# Altium schematic sheet Sheet1.SchDoc: RBCM_Core
size A2; SheetNumber: 1; SheetTotal: 1
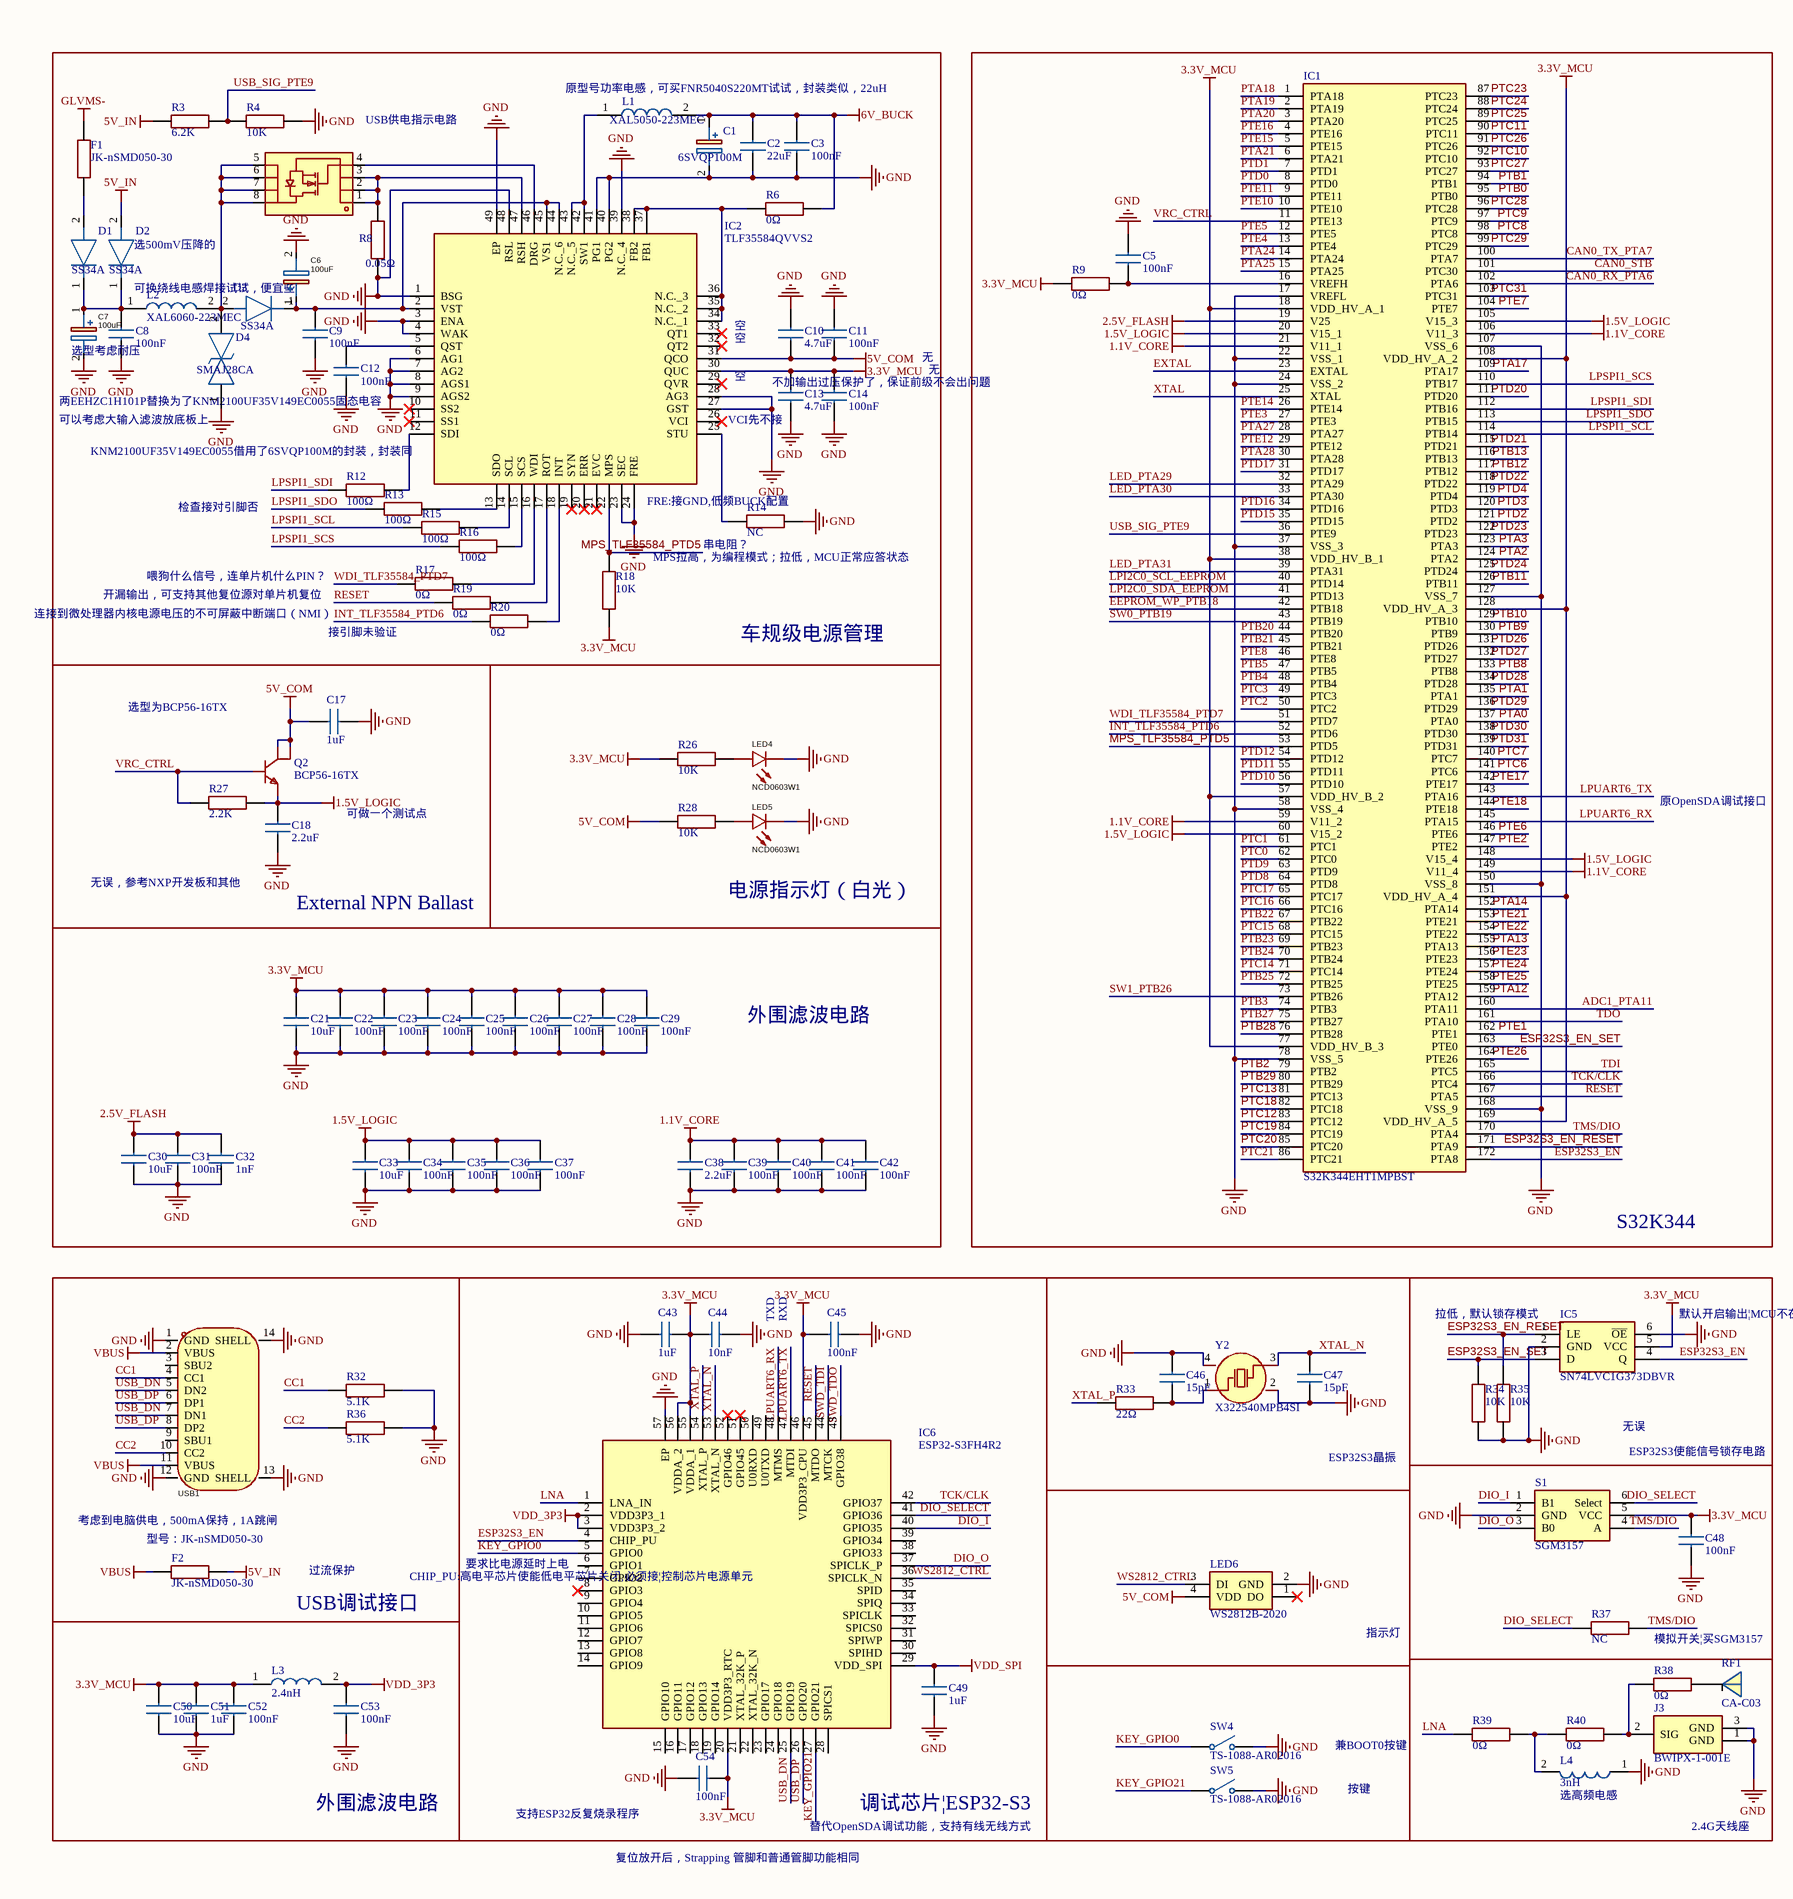
[diagram p0: Sheet1.SchDoc, left]
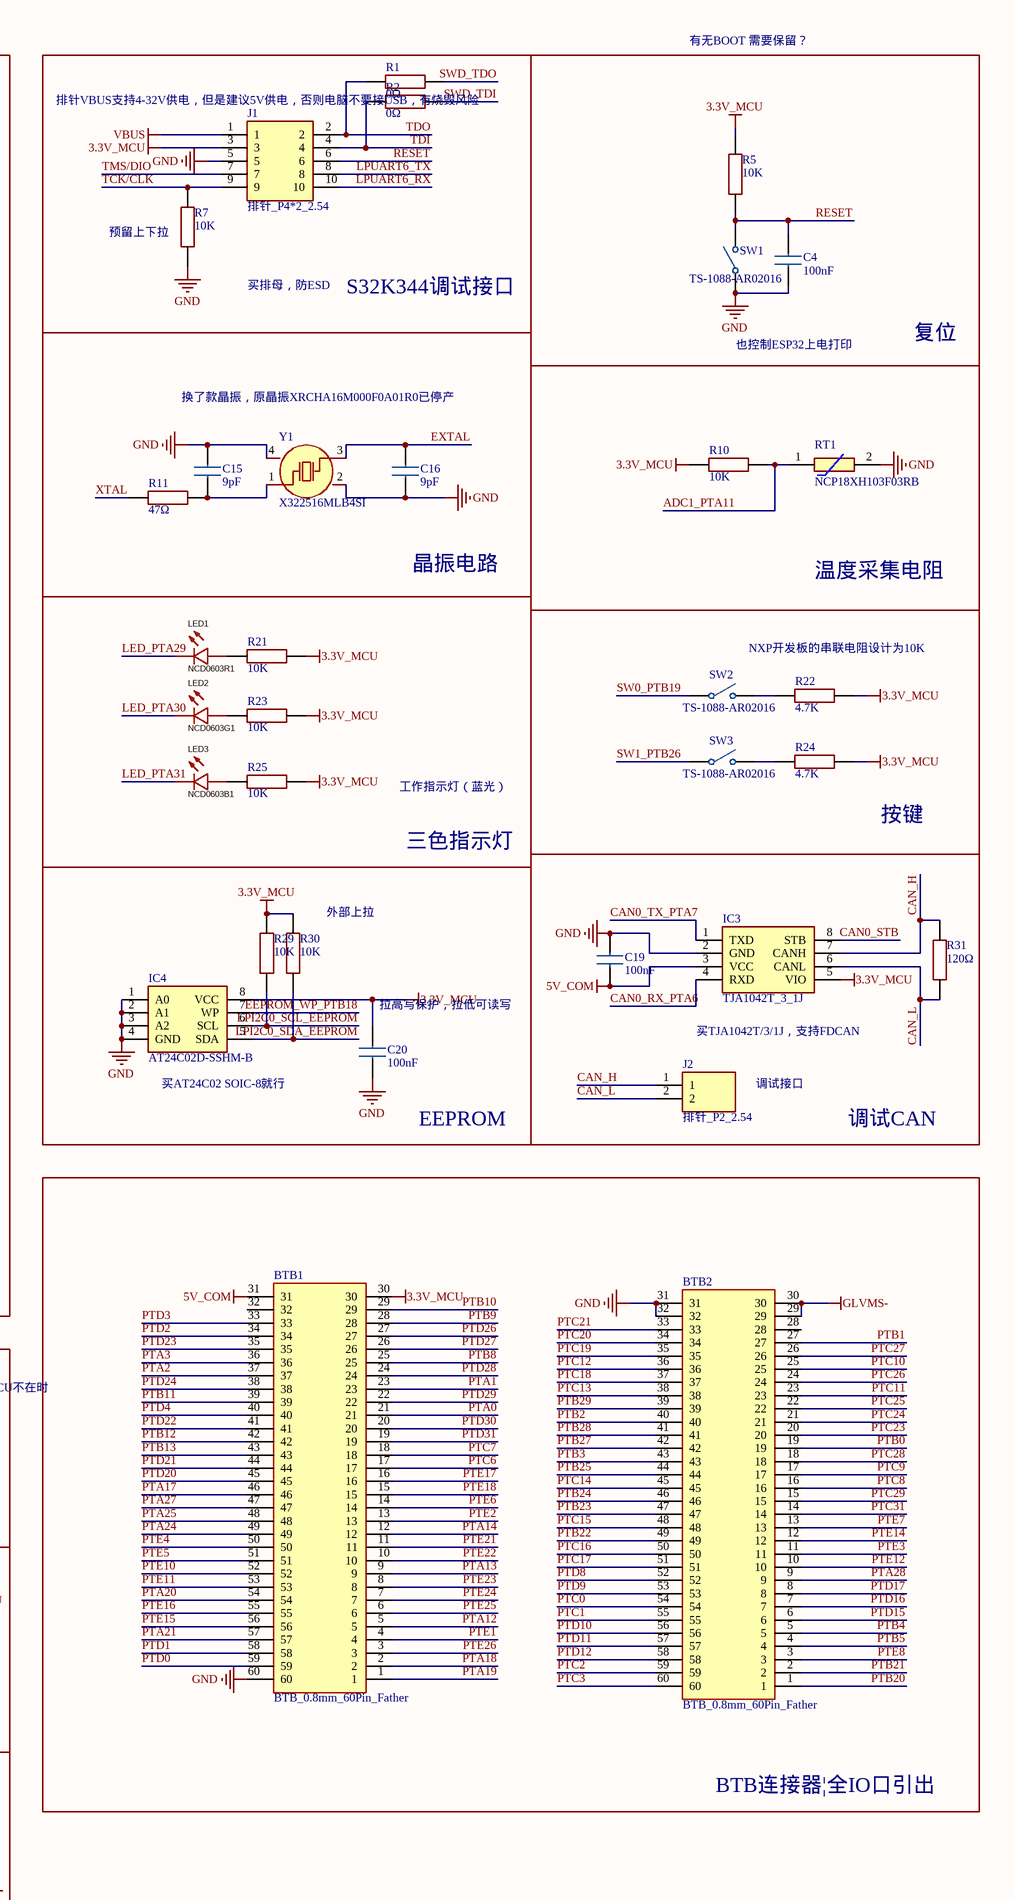
[diagram p1: Sheet1.SchDoc, right]

## Parts
BTB1  BTB_0.8mm_60Pin_Father  [BTB_0.8mm_60PIN_F]
BTB2  BTB_0.8mm_60Pin_Father  [BTB_0.8mm_60PIN_F]
C1  6SVQP100M  [16SVF180M]
C2  22uF  [CAPC1608X90N]
C3  100nF  [CAPC1608X90N]
C4  100nF  [CAPC1608X90N]
C5  100nF  [CAPC1608X90N]
C6  100uF  [16SVF180M]
C7  100uF  [16SVF180M]
C8  100nF  [CAPC1608X90N]
C9  100nF  [CAPC1608X90N]
C10  4.7uF  [CAPC1608X90N]
C11  100nF  [CAPC1608X90N]
C12  100nF  [CAPC1608X90N]
C13  4.7uF  [CAPC1608X90N]
C14  100nF  [CAPC1608X90N]
C15  9pF  [CAPC1608X90N]
C16  9pF  [CAPC1608X90N]
C17  1uF  [CAPC1608X90N]
C18  2.2uF  [CAPC1608X90N]
C19  100nF  [CAPC1608X90N]
C20  100nF  [CAPC1608X90N]
C21  10uF  [CAPC1608X90N]
C22  100nF  [CAPC1608X90N]
C23  100nF  [CAPC1608X90N]
C24  100nF  [CAPC1608X90N]
C25  100nF  [CAPC1608X90N]
C26  100nF  [CAPC1608X90N]
C27  100nF  [CAPC1608X90N]
C28  100nF  [CAPC1608X90N]
C29  100nF  [CAPC1608X90N]
C30  10uF  [CAPC1608X90N]
C31  100nF  [CAPC1608X90N]
C32  1nF  [CAPC1608X90N]
C33  10uF  [CAPC1608X90N]
C34  100nF  [CAPC1608X90N]
C35  100nF  [CAPC1608X90N]
C36  100nF  [CAPC1608X90N]
C37  100nF  [CAPC1608X90N]
C38  2.2uF  [CAPC1608X90N]
C39  100nF  [CAPC1608X90N]
C40  100nF  [CAPC1608X90N]
C41  100nF  [CAPC1608X90N]
C42  100nF  [CAPC1608X90N]
C43  1uF  [CAPC1608X90N]
C44  10nF  [CAPC1608X90N]
C45  100nF  [CAPC1608X90N]
C46  15pF  [CAPC1608X90N]
C47  15pF  [CAPC1608X90N]
C48  100nF  [CAPC1608X90N]
C49  1uF  [CAPC1608X90N]
C50  10uF  [CAPC1608X90N]
C51  1uF  [CAPC1608X90N]
C52  100nF  [CAPC1608X90N]
C53  100nF  [CAPC1608X90N]
C54  100nF  [CAPC1608X90N]
D1  SS34A  [DIOM5026X262N]
D2  SS34A  [DIOM5026X262N]
D3  SS34A  [DIOM5026X262N]
D4  SMAJ28CA  [DIONM5226X262N]
F1  JK-nSMD050-30  [RESC3116X65N]
F2  JK-nSMD050-30  [RESC3116X65N]
IC1  S32K344EHT1MPBST  [S32K344EHT1MPBST]
IC2  TLF35584QVVS2  [QFN50P700X700X90-49N-D]
IC3  TJA1042T_3_1J  [SOIC127P600X175-8N]
IC4  AT24C02D-SSHM-B  [SOIC127P600X175-8N]
IC5  SN74LVC1G373DBVR  [SOT95P280X145-6N]
IC6  ESP32-S3FH4R2  [QFN40P700X700X90-57N-D]
J1  排针_P4*2_2.54  [ZXPZ25425PZZ]
J2  排针_P2_2.54  [HDRV2W66P0X254_1X2_508X250X880P]
J3  BWIPX-1-001E  [BWIPX1001E]
L1  XAL5050-223MEC  [XAL5030]
L2  XAL6060-223MEC  [XAL6060822MEB]
L3  2.4nH  [LQM18FN100M00D]
L4  3nH  [LQM18FN100M00D]
LED1  NCD0603R1  [LED0603-RD]
LED2  NCD0603G1  [LED0603-RD_1]
LED3  NCD0603B1  [LED0603-RD]
LED4  NCD0603W1  [LED0603-RD]
LED5  NCD0603W1  [LED0603-RD]
LED6  WS2812B-2020  [WS2812B2020]
Q1  IPZ40N04S5L-7R4  [IPZ40N04S5L7R4ATMA1]  (value not drawn)
Q2  BCP56-16TX  [SOT230P700X180-4N]
R1  0Ω  [RESC1608X55N]
R2  0Ω  [RESC1608X55N]
R3  6.2K  [RESC1608X55N]
R4  10K  [RESC1608X55N]
R5  10K  [RESC1608X55N]
R6  0Ω  [RESC1608X55N]
R7  10K  [RESC1608X55N]
R8  0.05Ω  [RESC3116X65N]
R9  0Ω  [RESC1608X55N]
R10  10K  [RESC1608X55N]
R11  47Ω  [RESC1608X55N]
R12  100Ω  [RESC1608X55N]
R13  100Ω  [RESC1608X55N]
R14  NC  [RESC1608X55N]
R15  100Ω  [RESC1608X55N]
R16  100Ω  [RESC1608X55N]
R17  0Ω  [RESC1608X55N]
R18  10K  [RESC1608X55N]
R19  0Ω  [RESC1608X55N]
R20  0Ω  [RESC1608X55N]
R21  10K  [RESC1608X55N]
R22  4.7K  [RESC1608X55N]
R23  10K  [RESC1608X55N]
R24  4.7K  [RESC1608X55N]
R25  10K  [RESC1608X55N]
R26  10K  [RESC1608X55N]
R27  2.2K  [RESC1608X55N]
R28  10K  [RESC1608X55N]
R29  10K  [RESC1608X55N]
R30  10K  [RESC1608X55N]
R31  120Ω  [RESC1608X55N]
R32  5.1K  [RESC1608X55N]
R33  22Ω  [RESC1608X55N]
R34  10K  [RESC1608X55N]
R35  10K  [RESC1608X55N]
R36  5.1K  [RESC1608X55N]
R37  NC  [RESC1608X55N]
R38  0Ω  [RESC1608X55N]
R39  0Ω  [RESC1608X55N]
R40  0Ω  [RESC1608X55N]
RF1  CA-C03  [CA-C03]
RT1  NCP18XH103F03RB  [THRMC1608X95N]
S1  SGM3157  [SOT65P230X110-6N]
SW1  TS-1088-AR02016  [TS1088AR02016]
SW2  TS-1088-AR02016  [TS1088AR02016]
SW3  TS-1088-AR02016  [TS1088AR02016]
SW4  TS-1088-AR02016  [TS1088AR02016]
SW5  TS-1088-AR02016  [TS1088AR02016]
USB1  TYPE-C 16PIN 2MD(073)  [USB-C-SMD_TYPE-C-6PIN-2MD-073]  (value not drawn)
Y1  X322516MLB4SI  [X322516MLB4SI]
Y2  X322540MPB4SI  [X322540MPB4SI]

## Blocks framed on the sheet
车规级电源管理: C1-C3 C6-C14 D1-D4 F1 IC2 L1 L2 Q1 R3 R4 R6 R8 R12-R20
S32K344: C5 IC1 R9
S32K344调试接口: J1 R1 R2 R7
复位: C4 R5 SW1
晶振电路: C15 C16 R11 Y1
温度采集电阻: R10 RT1
三色指示灯: LED1-LED3 R21 R23 R25
按键: R22 R24 SW2 SW3
External NPN Ballast: C17 C18 Q2 R27
电源指示灯（白光）: LED4 LED5 R26 R28
调试CAN: C19 IC3 J2 R31
EEPROM: C20 IC4 R29 R30
外围滤波电路: C21-C42
BTB连接器¦全IO口引出: BTB1 BTB2
USB调试接口: F2 R32 R36 USB1
调试芯片¦ESP32-S3: C43-C45 C49 C54 IC6
ESP32S3晶振: C46 C47 R33 Y2
指示灯: LED6

## Nets
1.1V_CORE: C38.2 C39.2 C40.2 C41.2 C42.2 IC1.21(V11_1) IC1.59(V11_2) IC1.106(V11_3) IC1.149(V11_4)
1.5V_LOGIC: C18.2 C33.2 C34.2 C35.2 C36.2 C37.2 IC1.20(V15_1) IC1.60(V15_2) IC1.105(V15_3) IC1.148(V15_4) Q2.3(E) R27.2
2.5V_FLASH: C30.2 C31.2 C32.2 IC1.19(V25)
3.3V_MCU: BTB1.30 C13.2 C14.2 C20.2 C21.2 C22.2 C23.2 C24.2 C25.2 C26.2 C27.2 C28.2 C29.2 C43.2 C44.1 C45.1 C48.2 C50.2 C51.2 C52.2 C54.2 IC1.18(VDD_HV_A_1) IC1.38(VDD_HV_B_1) IC1.57(VDD_HV_B_2) IC1.77(VDD_HV_B_3) IC1.108(VDD_HV_A_2) IC1.128(VDD_HV_A_3) IC1.151(VDD_HV_A_4) IC1.169(VDD_HV_A_5) IC2.30(QUC) IC3.5(VIO) IC4.8(VCC) IC5.5(VCC) IC6.20(VDD3P3_RTC) IC6.46(VDD3P3_CPU) IC6.55(VDDA_1) IC6.56(VDDA_2) J1.3 L3.1 R5.2 R9.1 R10.1 R18.1 R21.2 R22.2 R23.2 R24.2 R25.2 R26.2 R29.2 R30.2 S1.5(VCC)
5V_COM: BTB1.31 C10.1 C11.1 C17.1 C19.1 IC2.31(QCO) IC3.3(VCC) LED6.4(VDD) Q2.2(C) Q2.4(C) R28.2
5V_IN: D2.2(A) F2.2 R3.1
6V_BUCK: C1.1(+) C2.2 C3.2 L1.2 R6.2
GLVMS-: BTB2.29 BTB2.30 F1.2
GND: BTB1.60 BTB2.31 BTB2.32 C1.2(-) C2.1 C3.1 C4.1 C5.2 C6.2(-) C7.2(-) C8.1 C9.1 C10.2 C11.2 C12.1 C13.1 C14.1 C15.2 C16.1 C17.2 C18.1 C19.2 C20.1 C21.1 C22.1 C23.1 C24.1 C25.1 C26.1 C27.1 C28.1 C29.1 C30.1 C31.1 C32.1 C33.1 C34.1 C35.1 C36.1 C37.1 C38.1 C39.1 C40.1 C41.1 C42.1 C43.1 C44.2 C45.2 C46.2 C47.1 C48.1 C49.1 C50.1 C51.1 C52.1 C53.1 C54.1 D4.1 IC1.17(VREFL) IC1.22(VSS_1) IC1.24(VSS_2) IC1.37(VSS_3) IC1.58(VSS_4) IC1.78(VSS_5) IC1.107(VSS_6) IC1.127(VSS_7) IC1.150(VSS_8) IC1.168(VSS_9) IC2.1(BSG) IC2.3(ENA) IC2.4(WAK) IC2.6(AG1) IC2.7(AG2) IC2.8(AGS1) IC2.9(AGS2) IC2.23(SEC) IC2.24(FRE) IC2.27(GST) IC2.28(AG3) IC2.39(N.C._4) IC2.40(PG2) IC2.41(PG1) IC2.48(RSL) IC2.49(EP) IC3.2(GND) IC4.1(A0) IC4.2(A1) IC4.3(A2) IC4.4(GND) IC5.2(GND) IC5.6(~{OE}) IC6.57(EP) J1.5 J3.1(GND) J3.3(GND) L4.1 LED4.1(-) LED5.1(-) LED6.2(GND) R4.2 R7.1 R8.1 R14.2 R32.2 R34.1 R35.1 R36.2 RT1.2 S1.2(GND) SW1.1(COMMON) SW4.2(NO) SW5.2(NO) USB1.1(GND) USB1.12(GND) USB1.13(SHELL) USB1.14(SHELL) Y1.2(GND) Y1.4(GND) Y2.2(GND) Y2.4(GND)
VBUS: F2.1 J1.1 USB1.2(VBUS) USB1.11(VBUS)
VDD_3P3: C53.2 IC6.2(VDD3P3_1) IC6.3(VDD3P3_2) L3.2
VDD_SPI: C49.2 IC6.29(VDD_SPI)
ADC1_PTA11: IC1.160(PTA11) R10.2 RT1.1
CAN0_RX_PTA6: IC1.102(PTA6) IC3.4(RXD)
CAN0_STB: IC1.101(PTC30) IC3.8(STB)
CAN0_TX_PTA7: IC1.100(PTA7) IC3.1(TXD)
CAN_H: IC3.7(CANH) J2.1 R31.2
CAN_L: IC3.6(CANL) J2.2 R31.1
CC1: R32.1 USB1.4(CC1)
CC2: R36.1 USB1.10(CC2)
DIO_I: IC6.40(GPIO35) S1.1(B1)
DIO_O: IC6.37(SPICLK_P) S1.3(B0)
DIO_SELECT: IC6.41(GPIO36) R37.1 S1.6(Select)
EEPROM_WP_PTB18: IC1.42(PTB18) IC4.7(WP)
ESP32S3_EN: IC1.172(PTA8) IC5.4(Q) IC6.4(CHIP_PU)
ESP32S3_EN_RESET: IC1.171(PTA9) IC5.1(LE) R35.2
ESP32S3_EN_SET: IC1.163(PTE0) IC5.3(D) R34.2
EXTAL: C16.2 IC1.23(EXTAL) Y1.3(OSC2)
INT_TLF35584_PTD6: IC1.52(PTD6) R20.1
KEY_GPIO0: IC6.5(GPIO0) SW4.1(COMMON)
KEY_GPIO21: IC6.27(GPIO21) SW5.1(COMMON)
LED_PTA29: IC1.32(PTA29) LED1.1(K)
LED_PTA30: IC1.33(PTA30) LED2.1(K)
LED_PTA31: IC1.39(PTA31) LED3.1(-)
LNA: IC6.1(LNA_IN) R39.1
LPI2C0_SCL_EEPROM: IC1.40(PTD14) IC4.6(SCL) R29.1
LPI2C0_SDA_EEPROM: IC1.41(PTD13) IC4.5(SDA) R30.1
LPSPI1_SCL: IC1.114(PTB14) R15.1
LPSPI1_SCS: IC1.110(PTB17) R16.1
LPSPI1_SDI: IC1.112(PTB16) R12.1
LPSPI1_SDO: IC1.113(PTB15) R13.1
LPUART6_RX: IC1.145(PTA15) IC6.48(MTMS) J1.10
LPUART6_TX: IC1.143(PTA16) IC6.47(MTDI) J1.8
MPS_TLF35584_PTD5: IC1.53(PTD5) IC2.22(MPS) R18.2
PTA0: BTB1.21 IC1.137(PTA0)
PTA1: BTB1.23 IC1.135(PTA1)
PTA2: BTB1.37 IC1.124(PTA2)
PTA3: BTB1.36 IC1.123(PTA3)
PTA12: BTB1.5 IC1.159(PTA12)
PTA13: BTB1.9 IC1.155(PTA13)
PTA14: BTB1.12 IC1.152(PTA14)
PTA17: BTB1.46 IC1.109(PTA17)
PTA18: BTB1.2 IC1.1(PTA18)
PTA19: BTB1.1 IC1.2(PTA19)
PTA20: BTB1.54 IC1.3(PTA20)
PTA21: BTB1.57 IC1.6(PTA21)
PTA24: BTB1.49 IC1.14(PTA24)
PTA25: BTB1.48 IC1.15(PTA25)
PTA27: BTB1.47 IC1.28(PTA27)
PTA28: BTB2.9 IC1.30(PTA28)
PTB0: BTB2.19 IC1.95(PTB0)
PTB1: BTB2.27 IC1.94(PTB1)
PTB2: BTB2.40 IC1.79(PTB2)
PTB3: BTB2.43 IC1.74(PTB3)
PTB4: BTB2.5 IC1.48(PTB4)
PTB5: BTB2.4 IC1.47(PTB5)
PTB8: BTB1.25 IC1.133(PTB8)
PTB9: BTB1.28 IC1.130(PTB9)
PTB10: BTB1.29 IC1.129(PTB10)
PTB11: BTB1.39 IC1.126(PTB11)
PTB12: BTB1.42 IC1.117(PTB12)
PTB13: BTB1.43 IC1.116(PTB13)
PTB20: BTB2.1 IC1.44(PTB20)
PTB21: BTB2.2 IC1.45(PTB21)
PTB22: BTB2.49 IC1.67(PTB22)
PTB23: BTB2.47 IC1.69(PTB23)
PTB24: BTB2.46 IC1.70(PTB24)
PTB25: BTB2.44 IC1.72(PTB25)
PTB27: BTB2.42 IC1.75(PTB27)
PTB28: BTB2.41 IC1.76(PTB28)
PTB29: BTB2.39 IC1.80(PTB29)
PTC0: BTB2.54 IC1.62(PTC0)
PTC1: BTB2.55 IC1.61(PTC1)
PTC2: BTB2.59 IC1.50(PTC2)
PTC3: BTB2.60 IC1.49(PTC3)
PTC6: BTB1.17 IC1.141(PTC6)
PTC7: BTB1.18 IC1.140(PTC7)
PTC8: BTB2.16 IC1.98(PTC8)
PTC9: BTB2.17 IC1.97(PTC9)
PTC10: BTB2.25 IC1.92(PTC10)
PTC11: BTB2.23 IC1.90(PTC11)
PTC12: BTB2.36 IC1.83(PTC12)
PTC13: BTB2.38 IC1.81(PTC13)
PTC14: BTB2.45 IC1.71(PTC14)
PTC15: BTB2.48 IC1.68(PTC15)
PTC16: BTB2.50 IC1.66(PTC16)
PTC17: BTB2.51 IC1.65(PTC17)
PTC18: BTB2.37 IC1.82(PTC18)
PTC19: BTB2.35 IC1.84(PTC19)
PTC20: BTB2.34 IC1.85(PTC20)
PTC21: BTB2.33 IC1.86(PTC21)
PTC23: BTB2.20 IC1.87(PTC23)
PTC24: BTB2.21 IC1.88(PTC24)
PTC25: BTB2.22 IC1.89(PTC25)
PTC26: BTB2.24 IC1.91(PTC26)
PTC27: BTB2.26 IC1.93(PTC27)
PTC28: BTB2.18 IC1.96(PTC28)
PTC29: BTB2.15 IC1.99(PTC29)
PTC31: BTB2.14 IC1.103(PTC31)
PTD0: BTB1.59 IC1.8(PTD0)
PTD1: BTB1.58 IC1.7(PTD1)
PTD2: BTB1.34 IC1.121(PTD2)
PTD3: BTB1.33 IC1.120(PTD3)
PTD4: BTB1.40 IC1.119(PTD4)
PTD8: BTB2.52 IC1.64(PTD8)
PTD9: BTB2.53 IC1.63(PTD9)
PTD10: BTB2.56 IC1.56(PTD10)
PTD11: BTB2.57 IC1.55(PTD11)
PTD12: BTB2.58 IC1.54(PTD12)
PTD15: BTB2.6 IC1.35(PTD15)
PTD16: BTB2.7 IC1.34(PTD16)
PTD17: BTB2.8 IC1.31(PTD17)
PTD20: BTB1.45 IC1.111(PTD20)
PTD21: BTB1.44 IC1.115(PTD21)
PTD22: BTB1.41 IC1.118(PTD22)
PTD23: BTB1.35 IC1.122(PTD23)
PTD24: BTB1.38 IC1.125(PTD24)
PTD26: BTB1.27 IC1.131(PTD26)
PTD27: BTB1.26 IC1.132(PTD27)
PTD28: BTB1.24 IC1.134(PTD28)
PTD29: BTB1.22 IC1.136(PTD29)
PTD30: BTB1.20 IC1.138(PTD30)
PTD31: BTB1.19 IC1.139(PTD31)
PTE1: BTB1.4 IC1.162(PTE1)
PTE2: BTB1.13 IC1.147(PTE2)
PTE3: BTB2.11 IC1.27(PTE3)
PTE4: BTB1.50 IC1.13(PTE4)
PTE5: BTB1.51 IC1.12(PTE5)
PTE6: BTB1.14 IC1.146(PTE6)
PTE7: BTB2.13 IC1.104(PTE7)
PTE8: BTB2.3 IC1.46(PTE8)
PTE10: BTB1.52 IC1.10(PTE10)
PTE11: BTB1.53 IC1.9(PTE11)
PTE12: BTB2.10 IC1.29(PTE12)
PTE14: BTB2.12 IC1.26(PTE14)
PTE15: BTB1.56 IC1.5(PTE15)
PTE16: BTB1.55 IC1.4(PTE16)
PTE17: BTB1.16 IC1.142(PTE17)
PTE18: BTB1.15 IC1.144(PTE18)
PTE21: BTB1.11 IC1.153(PTE21)
PTE22: BTB1.10 IC1.154(PTE22)
PTE23: BTB1.8 IC1.156(PTE23)
PTE24: BTB1.7 IC1.157(PTE24)
PTE25: BTB1.6 IC1.158(PTE25)
PTE26: BTB1.3 IC1.164(PTE26)
RESET: C4.2 IC1.167(PTA5) IC6.45(MTDO) J1.6 R5.1 R19.1 SW1.2(NO)
SW0_PTB19: IC1.43(PTB19) SW2.1(COMMON)
SW1_PTB26: IC1.73(PTB26) SW3.1(COMMON)
SWD_TDI: IC6.44(MTCK) R2.2
SWD_TDO: IC6.43(GPIO38) R1.2
TCK/CLK: IC1.166(PTC4) IC6.42(GPIO37) J1.9 R7.2
TDI: IC1.165(PTC5) J1.4 R2.1
TDO: IC1.161(PTA10) J1.2 R1.1
TMS/DIO: IC1.170(PTA4) J1.7 R37.2 S1.4(A)
USB_DN: IC6.25(GPIO19) USB1.5(DN2) USB1.7(DN1)
USB_DP: IC6.26(GPIO20) USB1.6(DP1) USB1.8(DP2)
USB_SIG_PTE9: IC1.36(PTE9) R3.2 R4.1
VRC_CTRL: IC1.11(PTE13) Q2.1(B) R27.1
WDI_TLF35584_PTD7: IC1.51(PTD7) R17.1
WS2812_CTRL: IC6.36(SPICLK_N) LED6.3(DI)
XTAL: IC1.25(XTAL) R11.1
XTAL_N: C47.2 IC6.53(XTAL_N) Y2.3(OSC2)
XTAL_P: IC6.54(XTAL_P) R33.1
NetC5_1: C5.1 IC1.16(VREFH) R9.2
NetC6_1: C6.1(+) C9.2 D3.1(K) IC2.2(VST) IC2.44(N.C._6) IC2.45(VS1)
NetC7_1: C7.1(+) C8.2 D1.1(K) D2.1(K) L2.1
NetC12_2: C12.2 IC2.5(QST)
NetC15_1: C15.1 R11.2 Y1.1(OSC1)
NetC46_1: C46.1 R33.2 Y2.1(OSC1)
NetD1_2: D1.2(A) F1.1
NetD3_2: D3.2(A) D4.2 L2.2 Q1.5(D) Q1.6(D) Q1.7(D) Q1.8(D)
NetIC2_12: IC2.12(SDI) R12.2
NetIC2_13: IC2.13(SDO) R13.2
NetIC2_14: IC2.14(SCL) R15.2
NetIC2_15: IC2.15(SCS) R16.2
NetIC2_16: IC2.16(WDI) R17.2
NetIC2_17: IC2.17(ROT) R19.2
NetIC2_18: IC2.18(INT) R20.2
NetIC2_25: IC2.25(STU) R14.1
NetIC2_34: IC2.34(N.C._1) IC2.35(N.C._2) IC2.36(N.C._3) IC2.37(FB1) IC2.38(FB2) R6.1
NetIC2_42: IC2.42(SW1) IC2.43(N.C._5) L1.1
NetIC2_46: IC2.46(DRG) Q1.4(G)
NetIC2_47: IC2.47(RSH) Q1.1(S) Q1.2(S) Q1.3(S) R8.2
NetJ3_2: J3.2(SIG) R38.1 R40.2
NetL4_2: L4.2 R39.2 R40.1
NetLED1_2: LED1.2(A) R21.1
NetLED2_2: LED2.2(A) R23.1
NetLED3_2: LED3.2(+) R25.1
NetLED4_2: LED4.2(+) R26.1
NetLED5_2: LED5.2(+) R28.1
NetR22_1: R22.1 SW2.2(NO)
NetR24_1: R24.1 SW3.2(NO)
NetR38_2: R38.2 RF1.1

Not connected (* = marked no-connect by the designer): BTB1 32; BTB2 28; IC2 10(SS2)* 11(SS1)* 19(SYN)* 20(ERR)* 21(EVC)* 26(VCI)* 29(QVR)* 32(QT2)* 33(QT1)*; IC6 6(GPIO1) 7(GPIO2) 8(GPIO3)* 9(GPIO4) 10(GPIO5) 11(GPIO6) 12(GPIO7) 13(GPIO8) 14(GPIO9) 15(GPIO10) 16(GPIO11) 17(GPIO12) 18(GPIO13) 19(GPIO14) 21(XTAL_32K_P) 22(XTAL_32K_N) 23(GPIO17) 24(GPIO18) 28(SPICS1) 30(SPIHD) 31(SPIWP) 32(SPICS0) 33(SPICLK) 34(SPIQ) 35(SPID) 38(GPIO33) 39(GPIO34) 49(U0TXD) 50(U0RXD) 51(GPIO45)* 52(GPIO46)*; LED6 1(DO)*; RF1 2; USB1 3(SBU2) 9(SBU1)

## Notes on the sheet
- 原型号功率电感，可买FNR5040S220MT试试，封装类似，22uH
- 有无BOOT 需要保留？
- (near Q1) USB供电指示电路
- (near J1) 排针VBUS支持4-32V供电，但是建议5V供电，否则电脑不要接USB，有烧毁风险
- (near D2) 选500mV压降的
- (near R7) 预留上下拉
- 买排母，防ESD
- 可换绕线电感焊接试试，便宜些
- 空
- 也控制ESP32上电打印
- (near C7) 选型考虑耐压
- 不加输出过压保护了，保证前级不会出问题
- 无
- 换了款晶振，原晶振XRCHA16M000F0A01R0已停产
- 可以考虑大输入滤波放底板上
- (near D4) 两EEHZC1H101P替换为了KNM2100UF35V149EC0055固态电容
- KNM2100UF35V149EC0055借用了6SVQP100M的封装，封装同
- VCI先不接
- 检查接对引脚否
- FRE:接GND,低频BUCK配置
- 喂狗什么信号，连单片机什么PIN？
- MPS拉高，为编程模式；拉低，MCU正常应答状态
- (near R14) 串电阻？
- 连接到微处理器内核电源电压的不可屏蔽中断端口（NMI）
- 开漏输出，可支持其他复位源对单片机复位
- 接引脚未验证
- NXP开发板的串联电阻设计为10K
- 选型为BCP56-16TX
- 工作指示灯（蓝光）
- 可做一个测试点
- 原OpenSDA调试接口
- 无误，参考NXP开发板和其他
- (near R30) 外部上拉
- (near C20) 拉高写保护，拉低可读写
- 买TJA1042T/3/1J，支持FDCAN
- (near IC4) 买AT24C02 SOIC-8就行
- 调试接口
- TXD
- RXD
- 拉低，默认锁存模式
- (near IC5) 默认开启输出¦MCU不在时
- 无误
- ESP32S3使能信号锁存电路
- 考虑到电脑供电，500mA保持，1A跳闸
- (near F2) 型号：JK-nSMD050-30
- 过流保护
- (near IC6) CHIP_PU:高电平芯片使能低电平芯片关闭,必须接¦控制芯片电源单元
- 要求比电源延时上电
- 模拟开关¦买SGM3157
- 兼BOOT0按键
- 外围滤波电路
- 支持ESP32反复烧录程序
- 替代OpenSDA调试功能，支持有线无线方式
- 按键
- (near L4) 选高频电感
- 2.4G天线座
- 复位放开后，Strapping 管脚和普通管脚功能相同
- ENG:
- DSN:
- APPROVALS
- DATE
- PROJECT REVISION:
- Vehicle Number:
- E33
- DOCUMENT REVISION:
- Wuhan University of Techonology
- Formula Student Electric Racing Team
- No. 122, Luoshi Road, Wuhan
- Hubei Provence, China
- Design Item:
- CHK:
- BOM:
- REFERENCE DOCUMENTS
- TITLE
- FAB DWG:
- PCB DWG:
- ASSY DWG:
- SCALE:
- A1
- SIZE
- FILE NAME
- WUTE racing team
- SHEET
- OF
- REV

## Library data of the parts
BTB1 BTB2 = BTB_0.8mm_60Pin_Father: System: Connector
C1 = 6SVQP100M: Capacitor Polarised; Manufacturer_Name: Panasonic; Datasheet Link: http://industrial.panasonic.com/cdbs/www-data/pdf/AAB8000/AAB8000C225.pdf; Height: 6mm; Manufacturer_Part_Number: 6SVQP100M; Mouser Part Number: 667-6SVQP100M; Mouser Price/Stock: https://www.mouser.co.uk/ProductDetail/Panasonic/6SVQP100M?qs=Gd3Cm49KlLNMtA4%252BBRbdEg%3D%3D; Arrow Part Number: 6SVQP100M; Arrow Price/Stock: https://www.arrow.com/en/products/6svqp100m/panasonic?region=nac
C2-C5 C8-C54 = C0603: Capacitor CC0603KRX7R9BB104; Manufacturer_Name: YAGEO; Datasheet Link: https://componentsearchengine.com/Datasheets/2/CC0603KRX7R9BB104.pdf; Height: 0.9mm; Manufacturer_Part_Number: CC0603KRX7R9BB104; Mouser Part Number: 603-CC603KRX7R9BB104; Mouser Price/Stock: https://www.mouser.co.uk/ProductDetail/YAGEO/CC0603KRX7R9BB104?qs=vTakOoo5QyLvVCYM2ge8LQ%3D%3D; Arrow Part Number: CC0603KRX7R9BB104; Arrow Price/Stock: https://www.arrow.com/en/products/cc0603krx7r9bb104/yageo?region=europe
C6 C7 = KNM2100UF35V149EC0055: Manufacturer: KNSCHA(科尼盛); Add into BOM: yes; Tolerance: ±20%; Rated Voltage: 35V; Ripple Current: 1.516A@100kHz; Equivalent Series Resistance(ESR): 80mΩ@100kHz; φD: 6.3mm; L: 7mm; Lifetime @ Temp: 2000hrs@105℃; Symbol: KNM2100UF35V149EC0055; Device: KNM2100UF35V149EC0055; LCSC Part Name: 100uF ±20% 35V; Supplier Part: C2982822; Manufacturer Part: KNM2100UF35V149EC0055; Supplier Footprint: SMD,D6.3xL7mm; JLCPCB Part Class: Extended Part; Datasheet: https://atta.szlcsc.com/upload/public/pdf/source/20220426/5696DDB0B22BE88A3CF8D074D2573DF7.pdf; Supplier: LCSC; Convert to PCB: yes; Value: 100uF; Lead Spacing: 2.5mm; Operating Temperature: -55℃~+105℃
D1-D3 = SS34A: Diode; Manufacturer_Name: HY Electronic; Datasheet Link: https://datasheet.datasheetarchive.com/originals/distributors/Datasheets-3/DSA-43252.pdf; Height: 2.62mm; Manufacturer_Part_Number: SS34A
D4 = SMAJ28CA: TVS Diode (Bi-directional); Manufacturer_Name: Bourns; Datasheet Link: https://www.bourns.com/data/global/pdfs/SMAJ.pdf; Height: 2.62mm; Manufacturer_Part_Number: SMAJ28CA; Mouser Part Number: 652-SMAJ28CA; Mouser Price/Stock: https://www.mouser.co.uk/ProductDetail/Bourns/SMAJ28CA?qs=A3H9pljuJ8Rc2FOBsYvsOw%3D%3D; Arrow Part Number: SMAJ28CA; Arrow Price/Stock: https://www.arrow.com/en/products/smaj28ca/bourns?utm_currency=USD&region=nac
F1 F2 = R1206: Manufacturer_Name: UNI-ROYAL(Uniroyal Elec); Manufacturer_Part_Number: 1206W4F1002T5E; Datasheet Link: https://datasheet.lcsc.com/szlcsc/Uniroyal-Elec-1206W4F1002T5E_C17902.pdf; Height: 0.65mm
IC1 = S32K344EHT1MPBST: Integrated Circuit; Manufacturer_Name: NXP; Datasheet Link: https://www.nxp.com/docs/en/data-sheet/S32K3xx.pdf; Height: 1.75mm; Manufacturer_Part_Number: S32K344EHT1MPBST; Mouser Part Number: 771-S32K344EHT1MPBST; Mouser Price/Stock: https://www.mouser.co.uk/ProductDetail/NXP-Semiconductors/S32K344EHT1MPBST?qs=Rp5uXu7WBW8J9n%252BPyXjBKQ%3D%3D; Arrow Part Number: S32K344EHT1MPBST; Arrow Price/Stock: https://www.arrow.com/en/products/s32k344eht1mpbst/nxp-semiconductors?region=nac
IC2 = TLF35584QVVS2: Integrated Circuit; Manufacturer_Name: Infineon; Datasheet Link: http://www.farnell.com/datasheets/2820312.pdf; Height: 0.9mm; Manufacturer_Part_Number: TLF35584QVVS2; Mouser Part Number: N/A; Mouser Price/Stock: https://www.mouser.co.uk/ProductDetail/Infineon-Technologies/TLF35584QVVS2?qs=l9vRkkPGK2mbsGIT9lqTbg%3D%3D
IC3 = TJA1042T_3_1J: Integrated Circuit; Manufacturer_Name: NXP; Manufacturer_Part_Number: TJA1042T/3/1J; Datasheet Link: http://www.nxp.com/docs/en/data-sheet/TJA1042.pdf; Height: 1.75mm; Mouser Part Number: 771-TJA1042T/3/1J; Mouser Price/Stock: https://www.mouser.co.uk/ProductDetail/NXP-Semiconductors/TJA1042T-3-1J?qs=gNSudQoqUYC0yGbZKhqwlQ%3D%3D; Arrow Part Number: TJA1042T/3/1J; Arrow Price/Stock: https://www.arrow.com/en/products/tja1042t31j/nxp-semiconductors?utm_currency=USD&region=nac
IC4 = AT24C02D-SSHM-B: Integrated Circuit; Manufacturer_Name: Microchip; Datasheet Link: http://www.atmel.com/images/Atmel-8871-SEEPROM-AT24C01D-02D-Datasheet.pdf; Height: 1.75mm; Manufacturer_Part_Number: AT24C02D-SSHM-B; Mouser Part Number: 556-AT24C02D-SSHM-B; Mouser Price/Stock: https://www.mouser.co.uk/ProductDetail/Microchip-Technology/AT24C02D-SSHM-B?qs=l5F7KFZg3O5xH%2Fgf1EqmGg%3D%3D; Arrow Part Number: AT24C02D-SSHM-B; Arrow Price/Stock: https://www.arrow.com/en/products/at24c02d-sshm-b/microchip-technology?region=europe
IC5 = SN74LVC1G373DBVR: Integrated Circuit; Manufacturer_Name: Texas Instruments; Datasheet Link: http://www.ti.com/lit/gpn/sn74lvc1g373; Height: 1.45mm; Manufacturer_Part_Number: SN74LVC1G373DBVR; Mouser Part Number: 595-SN74LVC1G373DBVR; Mouser Price/Stock: https://www.mouser.co.uk/ProductDetail/Texas-Instruments/SN74LVC1G373DBVR?qs=pajgIaoyDUhGcf%252BSO1j05w%3D%3D; Arrow Part Number: SN74LVC1G373DBVR; Arrow Price/Stock: https://www.arrow.com/en/products/sn74lvc1g373dbvr/texas-instruments?region=nac
IC6 = ESP32-S3FH4R2: Integrated Circuit; Manufacturer_Name: Espressif Systems; Datasheet Link: https://eu.mouser.com/datasheet/2/891/esp32_s3_datasheet_en-2946743.pdf; Height: 0.9mm; Manufacturer_Part_Number: ESP32-S3FH4R2; Mouser Part Number: 356-ESP32-S3FH4R2; Mouser Price/Stock: https://www.mouser.co.uk/ProductDetail/Espressif-Systems/ESP32-S3FH4R2?qs=tlsG%2FOw5FFjPrwkmZSBQNA%3D%3D
J1 = 排针_P4*2_2.54: Connector; Manufacturer_Name: Megastar; Manufacturer_Part_Number: ZX-PZ2.54-2-5PZZ; Datasheet Link: https://www.lcsc.com/datasheet/lcsc_datasheet_2311221544_Megastar-ZX-PZ2-54-2-5PZZ_C7501276.pdf; Height: 8.7mm
J2 = 排针_P2_2.54: Connector; Manufacturer_Name: Ckmtw(Shenzhen Cankemeng); Manufacturer_Part_Number: B-2100S02P-A110; Datasheet Link: https://datasheet.lcsc.com/lcsc/2210192330_Ckmtw-Shenzhen-Cankemeng-B-2100S02P-A110_C124375.pdf; Height: 8.8mm
J3 = BWIPX-1-001E: Connector; Manufacturer_Name: BAT WIRELESS; Datasheet Link: https://datasheet.lcsc.com/szlcsc/2012231509_BAT-WIRELESS-BWIPX-1-001E_C496552.pdf; Height: 1.45mm; Manufacturer_Part_Number: BWIPX-1-001E
L1 = XAL5050-223MEC: Inductor; Manufacturer_Name: COILCRAFT; Datasheet Link: https://www.coilcraft.com/getmedia/49bc46c8-4b2c-45b9-9b6c-2eaa235ea698/xal50xx.pdf; Manufacturer_Part_Number: XAL5050-223MEC; Mouser Part Number: 994-XAL5050-223MEC; Mouser Price/Stock: https://www.mouser.co.uk/ProductDetail/Coilcraft/XAL5050-223MEC?qs=zCSbvcPd3pZDBbGj4RTtgg%3D%3D
L2 = XAL6060-223MEC: Inductor; Manufacturer_Name: COILCRAFT; Datasheet Link: http://www.mouser.com/datasheet/2/597/xal60xx-270658.pdf; Height: 6mm; Manufacturer_Part_Number: XAL6060-223MEC; Mouser Part Number: 994-XAL6060-223MEC; Mouser Price/Stock: https://www.mouser.co.uk/ProductDetail/Coilcraft/XAL6060-223MEC?qs=zCSbvcPd3paScsLbTnAUcA%3D%3D
L3 L4 = L0603: Inductor; Manufacturer_Name: Murata Electronics; Datasheet Link: https://psearch.en.murata.com/inductor/product/LQM18FN100M00%23.html; Height: 0.9mm; Manufacturer_Part_Number: LQM18FN100M00D; Mouser Part Number: 81-LQM18FN100M00D; Mouser Price/Stock: https://www.mouser.co.uk/ProductDetail/Murata-Electronics/LQM18FN100M00D?qs=2%252BM72CStpDR8E8wEVXa5xw%3D%3D; Arrow Part Number: LQM18FN100M00D; Arrow Price/Stock: https://www.arrow.com/en/products/lqm18fn100m00d/murata-manufacturing?region=nac
LED1 = NCD0603R1: C84263; Manufacturer: 国星光电; Symbol: FC-DA1608HRK-620D; Device: NCD0603R1_C84263; Add into BOM: yes; Emitted Color: 红色; Forward Voltage (VF): 1.6V~2.6V; Power Dissipation: 65mW; Forward Current: 20mA; Dominant Wavelength: 615nm~630nm; Diode Configuration: 独立二极管; Lens Color: 无色透明透镜; Luminous Intensity: 80mcd~220mcd; Viewing Angle: 130°; LCSC Part Name: NCD0603R1; Supplier Part: C84263; Manufacturer Part: NCD0603R1; Supplier Footprint: 0603; JLCPCB Part Class: Extended Part; Datasheet: https://atta.szlcsc.com/upload/public/pdf/source/20200820/C84263_DABC6A75E58F576973B407FDBA283D60.pdf; Supplier: LCSC; Convert to PCB: yes; Lamp Holder Type: -; Peak Wavelength: -; Color Temperature: -; Mounting Sytle: -; Operating Temperature: -30℃~+85℃
LED2 = NCD0603G1: Manufacturer: 国星光电; Symbol: FC-D1608UGK-520D10; Add into BOM: yes; Emitted Color: 翠绿色; Forward Voltage (VF): 2.6V~3.6V; Power Dissipation: 72mW; Forward Current: 10mA; Dominant Wavelength: 515nm~530nm; Lens Color: 无色透明透镜; Luminous Intensity: 330mcd~900mcd; Viewing Angle: 130°; Device: NCD0603G1; LCSC Part Name: NCD0603G1; Supplier Part: C84267; Manufacturer Part: NCD0603G1; Supplier Footprint: 0603; JLCPCB Part Class: Extended Part; Datasheet: https://atta.szlcsc.com/upload/public/pdf/source/20200820/C84267_04BA7703640BAC111D09F5EFB971FBF3.pdf; Supplier: LCSC; Convert to PCB: yes; Operating Temperature: -30℃~+85℃
LED3 = NCD0603B1: Manufacturer: 国星光电; Symbol: FC-DA1608BK-470H10; Add into BOM: yes; Emitted Color: 蓝色; Forward Voltage (VF): 2.6V~3.6V; Power Dissipation: 72mW; Forward Current: 10mA; Dominant Wavelength: 463nm~475nm; Lens Color: 无色透明透镜; Luminous Intensity: 80mcd~220mcd; Viewing Angle: 130°; Device: NCD0603B1; LCSC Part Name: NCD0603B1; Supplier Part: C84266; Manufacturer Part: NCD0603B1; Supplier Footprint: 0603; JLCPCB Part Class: Extended Part; Datasheet: https://atta.szlcsc.com/upload/public/pdf/source/20200820/C84266_6A3CDBEFA72C6CAD68EDA53474ADAE6C.pdf; Supplier: LCSC; Convert to PCB: yes; Operating Temperature: -30℃~+85℃
LED4 LED5 = NCD0603W1: Manufacturer: 国星光电; Symbol: FC-D1608WD-460H5; Add into BOM: yes; Emitted Color: 白色; Forward Voltage (VF): 2.6V~3.6V; Power Dissipation: 72mW; Forward Current: 5mA; Lens Color: 雾状黄透镜; Luminous Intensity: 200mcd~300mcd; Viewing Angle: 130°; Device: NCD0603W1; LCSC Part Name: NCD0603W1; Supplier Part: C84265; Manufacturer Part: NCD0603W1; Supplier Footprint: 0603; JLCPCB Part Class: Extended Part; Datasheet: https://atta.szlcsc.com/upload/public/pdf/source/20200820/C84265_479E6193713348A548E5CD6D9278BF16.pdf; Supplier: LCSC; Convert to PCB: yes; Operating Temperature: -30℃~+85℃
LED6 = WS2812B-2020: LED (Multiple); Manufacturer_Name: Worldsemi; Datasheet Link: https://www.alldatasheet.com/datasheet-pdf/pdf/1134522/WORLDSEMI/WS2812B-2020.html; Height: 0.84mm; Manufacturer_Part_Number: WS2812B-2020
Q1 = IPZ40N04S5L-7R4: Manufacturer: Infineon(英飞凌); Add into BOM: yes; Symbol: IPZ40N04S5L-7R4; Device: IPZ40N04S5L-7R4; LCSC Part Name: IPZ40N04S5L-7R4; Supplier Part: C537509; Manufacturer Part: IPZ40N04S5L-7R4; Supplier Footprint: TSDSON-8-EP(3.3x3.3); JLCPCB Part Class: Extended Part; Datasheet: https://atta.szlcsc.com/upload/public/pdf/source/20200525/C537509_E051284C2A14EA783116935AFB10216D.pdf; Supplier: LCSC; Convert to PCB: yes; Type: -; Drain Source Voltage (Vdss): -; Continuous Drain Current (Id): -; Power Dissipation (Pd): -; Drain Source On Resistance (RDS(on)@Vgs,Id): -; Gate Threshold Voltage (Vgs(th)@Id): -; Total Gate Charge (Qg@Vgs): -; Input Capacitance (Ciss@Vds): -; Reverse Transfer Capacitance (Crss@Vds): -
Q2 = BCP56-16TX: Transistor; Manufacturer_Name: Nexperia; Manufacturer_Part_Number: BCP56-16,115; Datasheet Link: https://assets.nexperia.com/documents/data-sheet/BCP56_BCX56_BC56PA.pdf; Height: 1.8mm; Mouser Part Number: 771-BCP56-16-T/R; Mouser Price/Stock: https://www.mouser.co.uk/ProductDetail/Nexperia/BCP56-16115?qs=me8TqzrmIYWgUkLKLwMxWw%3D%3D; Arrow Part Number: BCP56-16,115; Arrow Price/Stock: https://www.arrow.com/en/products/bcp56-16115/nexperia?utm_currency=USD&region=europe
R1-R7 R9-R40 = R0603: Resistor 0603WAF1002T5E; Manufacturer_Name: UNI-ROYAL(Uniroyal Elec); Datasheet Link: https://datasheet.lcsc.com/szlcsc/Uniroyal-Elec-0603WAF1002T5E_C25804.pdf; Height: 0.55mm; Manufacturer_Part_Number: 0603WAF1002T5E
R8 = R1206: Resistor 1206W4F1002T5E; Manufacturer_Name: UNI-ROYAL(Uniroyal Elec); Datasheet Link: https://datasheet.lcsc.com/szlcsc/Uniroyal-Elec-1206W4F1002T5E_C17902.pdf; Height: 0.65mm; Manufacturer_Part_Number: 1206W4F1002T5E
RT1 = NCP18XH103F03RB: Thermistor; Manufacturer_Name: Murata Electronics; Datasheet Link: https://componentsearchengine.com/Datasheets/2/NCP18XH103F03RB.pdf; Height: 0.95mm; Manufacturer_Part_Number: NCP18XH103F03RB; Mouser Part Number: 81-NCP18XH103F03RB; Mouser Price/Stock: https://www.mouser.co.uk/ProductDetail/Murata-Electronics/NCP18XH103F03RB?qs=k3rQb2PKXqkF9YvF09qsvw%3D%3D; Arrow Part Number: NCP18XH103F03RB; Arrow Price/Stock: https://www.arrow.com/en/products/ncp18xh103f03rb/murata-manufacturing?utm_currency=USD&region=nac
S1 = SGM3157: Switch; Manufacturer_Name: SGMICRO; Manufacturer_Part_Number: SGM3157YC6/TR; Datasheet Link: https://pdf1.alldatasheet.com/datasheet-pdf/view/224033/SGMICRO/SGM3157YC6/TR.html; Height: 1.1mm
SW1-SW5 = TS-1088-AR02016: Switch; Manufacturer_Name: XUNPU; Datasheet Link: https://www.xunpudianzi.com/uploads/pdf/TS-1088-ARXXX.pdf; Height: 2mm; Manufacturer_Part_Number: TS-1088-AR02016
USB1 = TYPE-C 16PIN 2MD(073): Manufacturer: SHOU HAN(首韩); Add into BOM: yes; Gender: 母; Number of Contacts: 16P; Number of Ports: 1; Current Rating - Power (Max): 5A; Rated Voltage (Max): 5V; Connect-Disconnect Life: 5千次; Core Colour: 黑色; Symbol: TYPE-C 16PIN 2MD(073); Device: TYPE-C 16PIN 2MD(073); LCSC Part Name: Type-C 母 卧贴; Supplier Part: C2765186; Manufacturer Part: TYPE-C 16PIN 2MD(073); Supplier Footprint: SMD; JLCPCB Part Class: Extended Part; Datasheet: https://atta.szlcsc.com/upload/public/pdf/source/20211123/39B17C16241EAC15C5E277BDA434118E.pdf; Supplier: LCSC; Convert to PCB: yes; Connector Type: Type-C; Standard: USB 3.1; Mounting Style: 卧贴; Operating Temperature Range: -25℃~+85℃
Y1 = X322516MLB4SI: Crystal or Oscillator; Manufacturer_Name: Yangxing Tech; Datasheet Link: https://datasheet.lcsc.com/szlcsc/Yangxing-Tech-X322516MLB4SI_C13738.pdf; Height: 0.8mm; Manufacturer_Part_Number: X322516MLB4SI
Y2 = X322540MPB4SI: Crystal or Oscillator; Manufacturer_Name: Yangxing Tech; Datasheet Link: https://datasheet.lcsc.com/szlcsc/Yangxing-Tech-X322540MPB4SI_C9010.pdf; Height: 0.8mm; Manufacturer_Part_Number: X322540MPB4SI